# EAGLE design command (EAGLE 5.10)
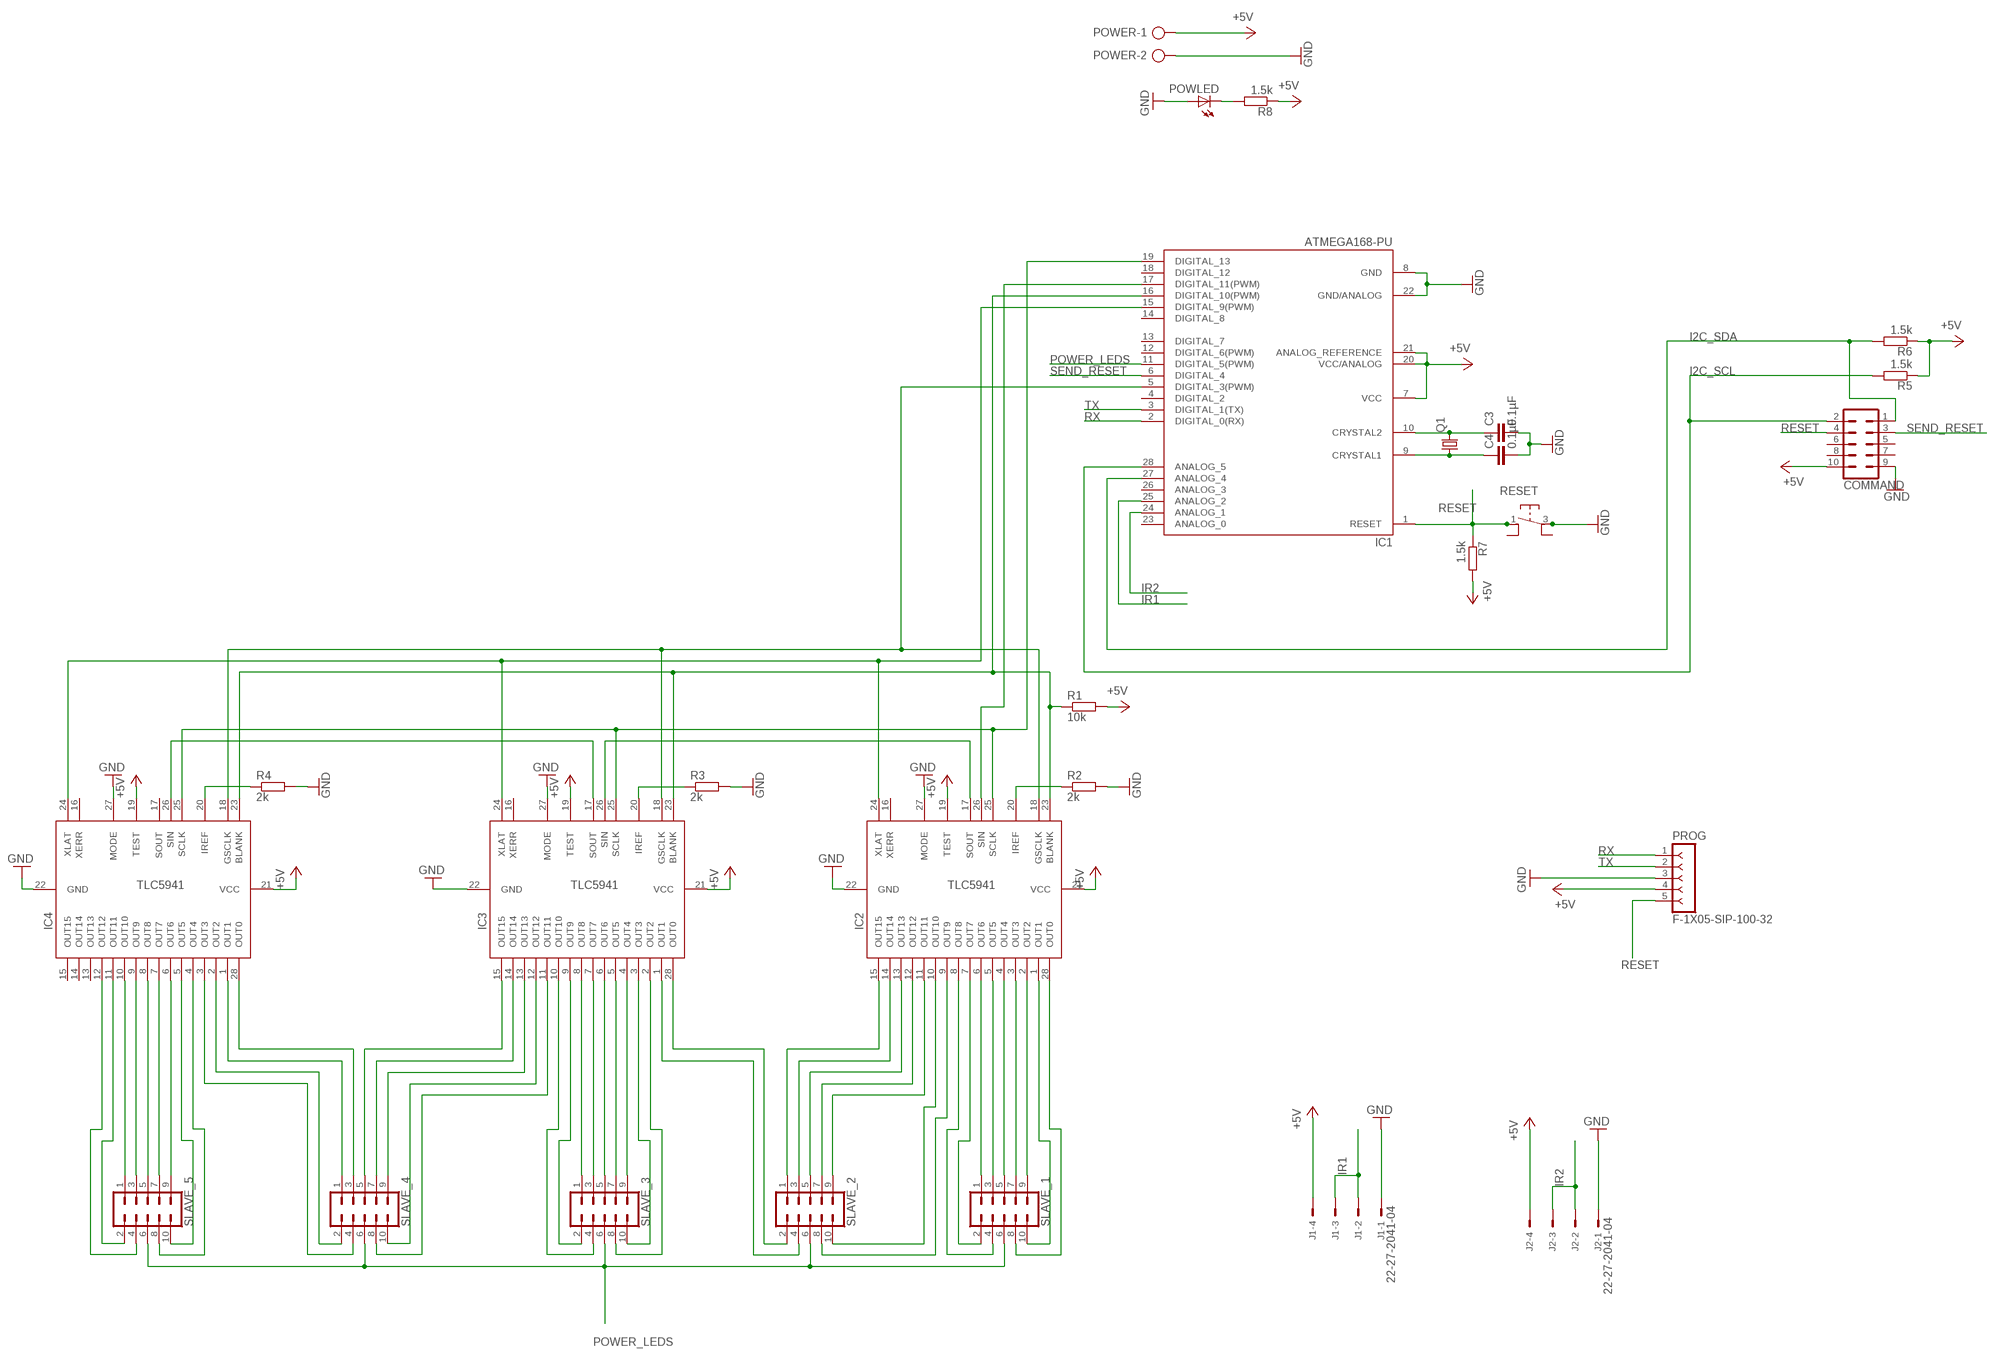
[diagram p0: schematic, sheet 1]

## Parts
C3  0.1µF  C-EU050-025X075  [C050-025X075]
C4  0.1µF  C-EU050-025X075  [C050-025X075]
COMMAND  ML10  [ML10]
IC1  ATMEGA168-PU  [DIL28-3]
IC2  TLC5941NT  [DIL28-3]
IC3  TLC5941NT  [DIL28-3]
IC4  TLC5941NT  [DIL28-3]
J1  22-27-2041-04  [6410-04]
J2  22-27-2041-04  [6410-04]
POWER  AK500/2  [AK500/2]
POWLED  LEDCHIP-LED0805  [CHIP-LED0805]
PROG  F-1X05-SIP-100-32  [SIP-100-05-32]
Q1  CRYSTALHC49U70  [HC49U70]
R1  10k  R-EU_0207/10  [0207/10]
R2  2k  R-EU_0207/10  [0207/10]
R3  2k  R-EU_0207/10  [0207/10]
R4  2k  R-EU_0207/10  [0207/10]
R5  1.5k  R-EU_0207/10  [0207/10]
R6  1.5k  R-EU_0207/10  [0207/10]
R7  1.5k  R-EU_0207/10  [0207/10]
R8  1.5k  R-EU_0207/10  [0207/10]
RESET  BUTTON_6X6_THRU  [6X6_BUTTON_THRU]
SLAVE_1  ML10  [ML10]
SLAVE_2  ML10  [ML10]
SLAVE_3  ML10  [ML10]
SLAVE_4  ML10  [ML10]
SLAVE_5  ML10  [ML10]

## Nets
+5V: COMMAND.10 IC1.7(VCC) IC1.20(VCC/ANALOG) IC1.21(ANALOG_REFERENCE) IC2.19(TEST) IC2.21(VCC) IC3.19(TEST) IC3.21(VCC) IC4.19(TEST) IC4.21(VCC) J1.4 J2.4 POWER.1 PROG.4 R1.2 R5.1 R6.1 R7.2 R8.1
B3: IC2.8(OUT8) SLAVE_1.4
B4: IC2.11(OUT11) SLAVE_2.9
B5: IC2.14(OUT14) SLAVE_2.3
B6: IC3.1(OUT1) SLAVE_2.4
B9: IC3.10(OUT10) SLAVE_3.4
B10: IC3.13(OUT13) SLAVE_4.9
B11: IC4.28(OUT0) SLAVE_4.3
B12: IC4.3(OUT3) SLAVE_4.4
B15: IC4.12(OUT12) SLAVE_5.4
BLANK: IC1.16(DIGITAL_10(PWM)) IC2.23(BLANK) IC3.23(BLANK) IC4.23(BLANK) R1.1
G1: IC2.1(OUT1) SLAVE_1.10
G3: IC2.7(OUT7) SLAVE_1.2
G4: IC2.10(OUT10) SLAVE_2.10
G5: IC2.13(OUT13) SLAVE_2.5
G6: IC3.28(OUT0) SLAVE_2.2
G7: IC3.3(OUT3) SLAVE_3.10
G9: IC3.9(OUT9) SLAVE_3.2
G10: IC3.12(OUT12) SLAVE_4.10
G11: IC3.15(OUT15) SLAVE_4.5
G12: IC4.2(OUT2) SLAVE_4.2
G13: IC4.5(OUT5) SLAVE_5.10
G15: IC4.11(OUT11) SLAVE_5.2
GND: C3.2 C4.2 COMMAND.9 IC1.8(GND) IC1.22(GND/ANALOG) IC2.22(GND) IC2.27(MODE) IC3.22(GND) IC3.27(MODE) IC4.22(GND) IC4.27(MODE) J1.1 J2.1 POWER.2 POWLED.A PROG.3 R2.2 R3.2 R4.2 RESET.3(P1)
GSCLK: IC1.5(DIGITAL_3(PWM)) IC2.18(GSCLK) IC3.18(GSCLK) IC4.18(GSCLK)
I2C_SCL: COMMAND.2 IC1.28(ANALOG_5) R5.2
I2C_SDA: COMMAND.1 IC1.27(ANALOG_4) R6.2
IR1: IC1.25(ANALOG_2) J1.2 J1.3
IR2: IC1.24(ANALOG_1) J2.2 J2.3
N$1: IC1.17(DIGITAL_11(PWM)) IC2.26(SIN)
N$2: C3.1 IC1.10(CRYSTAL2) Q1.2
N$3: C4.1 IC1.9(CRYSTAL1) Q1.1
N$5: IC4.10(OUT10) SLAVE_5.1
N$6: IC2.20(IREF) R2.1
N$7: IC2.17(SOUT) IC3.26(SIN)
N$8: IC3.17(SOUT) IC4.26(SIN)
N$9: IC3.20(IREF) R3.1
N$10: IC4.20(IREF) R4.1
N$11: IC4.9(OUT9) SLAVE_5.3
N$12: IC4.8(OUT8) SLAVE_5.5
N$13: IC4.7(OUT7) SLAVE_5.7
N$14: IC4.6(OUT6) SLAVE_5.9
N$15: IC3.4(OUT4) SLAVE_3.9
N$16: IC3.5(OUT5) SLAVE_3.7
N$17: IC3.6(OUT6) SLAVE_3.5
N$18: IC3.7(OUT7) SLAVE_3.3
N$19: IC3.8(OUT8) SLAVE_3.1
N$20: IC2.2(OUT2) SLAVE_1.9
N$21: IC2.3(OUT3) SLAVE_1.7
N$22: IC2.4(OUT4) SLAVE_1.5
N$23: IC2.5(OUT5) SLAVE_1.3
N$24: IC2.6(OUT6) SLAVE_1.1
N$25: POWLED.C R8.2
POWER_LEDS: IC1.11(DIGITAL_5(PWM)) SLAVE_1.6 SLAVE_2.6 SLAVE_3.6 SLAVE_4.6 SLAVE_5.6
R1: IC2.28(OUT0) SLAVE_1.8
R4: IC2.9(OUT9) SLAVE_2.8
R5: IC2.12(OUT12) SLAVE_2.7
R6: IC2.15(OUT15) SLAVE_2.1
R7: IC3.2(OUT2) SLAVE_3.8
R10: IC3.11(OUT11) SLAVE_4.8
R11: IC3.14(OUT14) SLAVE_4.7
R12: IC4.1(OUT1) SLAVE_4.1
R13: IC4.4(OUT4) SLAVE_5.8
RESET: COMMAND.4 IC1.1(RESET) PROG.5 R7.1 RESET.1(P2)
RX: IC1.2(DIGITAL_0(RX)) PROG.1
SCLK: IC1.19(DIGITAL_13) IC2.25(SCLK) IC3.25(SCLK) IC4.25(SCLK)
SEND_RESET: COMMAND.3 IC1.6(DIGITAL_4)
TX: IC1.3(DIGITAL_1(TX)) PROG.2
XLAT: IC1.15(DIGITAL_9(PWM)) IC2.24(XLAT) IC3.24(XLAT) IC4.24(XLAT)
Unconnected: COMMAND.5 COMMAND.6 COMMAND.7 COMMAND.8 IC1.4(DIGITAL_2) IC1.12(DIGITAL_6(PWM)) IC1.13(DIGITAL_7) IC1.14(DIGITAL_8) IC1.18(DIGITAL_12) IC1.23(ANALOG_0) IC1.26(ANALOG_3) IC2.16(XERR) IC3.16(XERR) IC4.13(OUT13) IC4.14(OUT14) IC4.15(OUT15) IC4.16(XERR) IC4.17(SOUT) RESET.2 RESET.4(P1)

## Library data of the parts
C3 C4 = rcl:C-EU: CAPACITOR, European symbol
COMMAND SLAVE_1-SLAVE_5 = con-ml:ML10: HARTING; OC_FARNELL: unknown; OC_NEWARK: unknown
IC1 = Arduino-AVR:ATMEGA168-PU
IC2-IC4 = adafruit:TLC5941
J1 J2 = con-molex:22-?-04: CONNECTOR wire to board 2.54 mm (.1 inch) pitch header; OC_FARNELL: unknown; OC_NEWARK: unknown
POWER = con-ptr500:AK500/2: CONNECTOR; OC_FARNELL: unknown; OC_NEWARK: unknown
POWLED = 0-svo:LED: LED OSRAM: - CHIPLED LG R971, LG N971, LY N971, LG Q971, LY Q971, LO R971, LY R971 LH N974, LH R974 LS Q976, LO Q976, LY Q976 LO Q996 - Hyper CHIPLED LW Q18S LB Q993, LB Q99A, LB R99A - SideLED LS A670, LO A670, LY A670, LG A670, LP A670 LB A673, LV A673, LT A673, LW A673 LH A674 LY A675 LS A676, LA A676, LO A676, LY A676, LW A676 LS A679, LY A679, LG A679 - Hyper Micro SIDELED® LS Y876, LA Y876, LO Y876, LY Y876 LT Y87S - SmartLED LW L88C, LW L88S LB L89C, LB L89S, LG L890 LS L89K, LO L89K, LY L89K LS L896, LA L896, LO L896, LY L896 - TOPLED LS T670, LO T670, LY T670, LG T670, LP T670 LSG T670, LSP T670, LSY T670, LOP T670, LYG T670 LG T671, LOG T671, LSG T671 LB T673, LV T673, LT T673, LW T673 LH T674 LS T676, LA T676, LO T676, LY T676, LB T676, LH T676, LSB T676, LW T676 LB T67C, LV T67C, LT T67C, LS T67K, LO T67K, LY T67K, LW E67C LS E67B, LA E67B, LO E67B, LY E67B, LB E67C, LV E67C, LT E67C LW T67C LS T679, LY T679, LG T679 LS T770, LO T770, LY T770, LG T770, LP T770 LB T773, LV T773, LT T773, LW T773 LH T774 LS E675, LA E675, LY E675, LS T675 LS T776, LA T776, LO T776, LY T776, LB T776 LHGB T686 LT T68C, LB T68C - Hyper Mini TOPLED® LB M676 - Mini TOPLED Santana® LG M470 LS M47K, LO M47K, LY M47K Source: http://www.osram.convergy.de/
PROG = con-headers-jp:F-1X05-: FEMALE HEADER
Q1 = crystal:CRYSTAL: CRYSTAL; OC_FARNELL: unknown; OC_NEWARK: unknown
R1-R8 = rcl:R-EU_: RESISTOR, European symbol
RESET = 0-svo:BUTTON_6X6_*

## Board
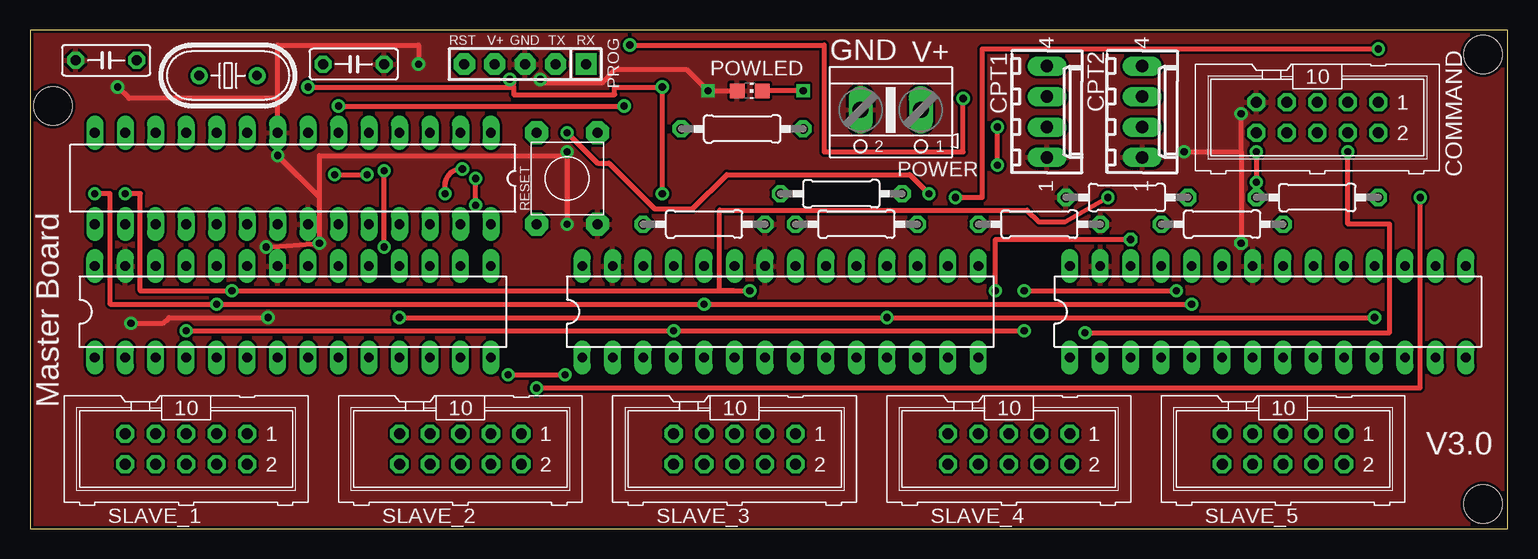
[diagram p1: board, top side]
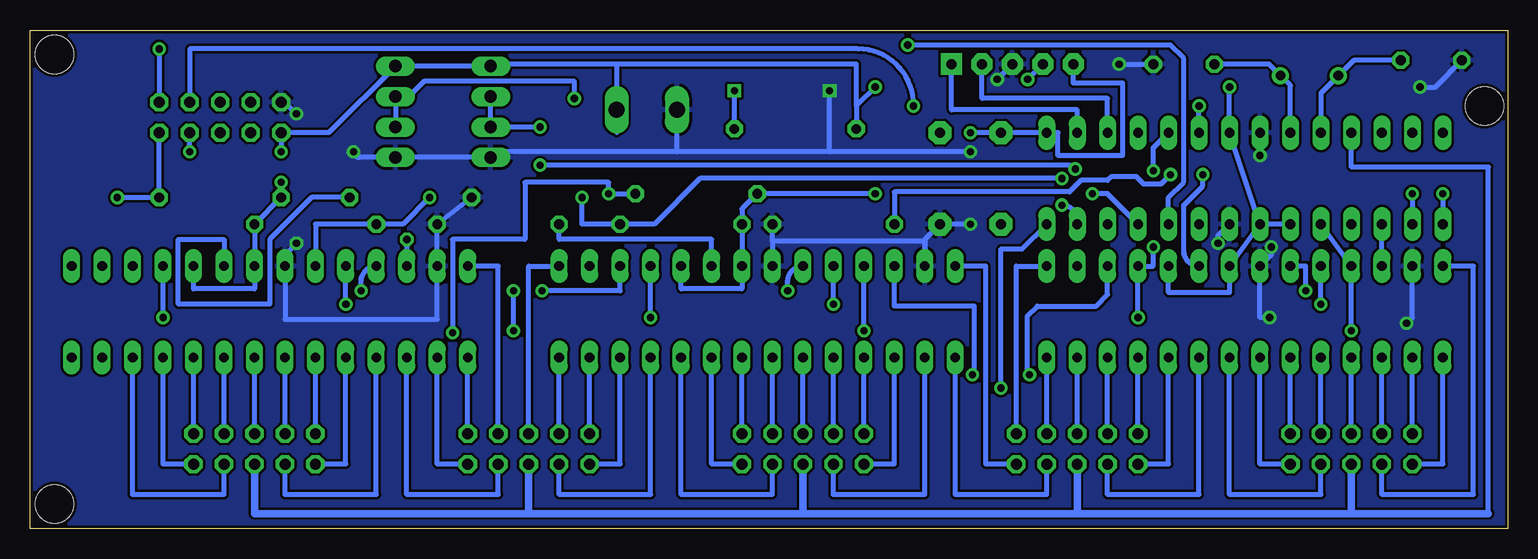
[diagram p2: board, bottom side, seen from below]

Size 123.17 x 41.58 mm. Coordinates in mm from the lower left corner, seen from the top.
Outline: 0,0 123.17,0 123.17,41.58 0,41.58 0,0
Copper layers (1*16): Top 0.035mm / dielectric 1.5mm / Bottom 0.035mm
Design rules "SparkFun": minimum track width 8mil, minimum drill 20mil, track to track 8mil, track to pad 8mil, pad to pad 8mil, via to via 8mil, smd to smd 8mil, copper to edge 10mil, drill to drill 8mil, minimum pad ring 12mil, minimum via ring 10mil, stop-mask expansion 4mil, vias tented up to drill 25mil, thermal gap 10mil
Holes 3.2 mm at 121.13,39.53 121.13,2.06 1.91,35.24

### Footprints (pad centres in the part's own frame; a part is rotated, then mirrored left to right if it is on the bottom)
C050-025X075 = drill 0.813 octagon: 1 -2.54,0; 2 2.54,0
ML10 = drill 0.914 octagon: 1 -5.08,-1.27; 2 -5.08,1.27; 3 -2.54,-1.27; 4 -2.54,1.27; 5 0,-1.27; 6 0,1.27; 7 2.54,-1.27; 8 2.54,1.27; 9 5.08,-1.27; 10 5.08,1.27
DIL28-3 = drill 0.813 long: 1 -16.51,-3.81; 2 -13.97,-3.81; 3 -11.43,-3.81; 4 -8.89,-3.81; 5 -6.35,-3.81; 6 -3.81,-3.81; 7 -1.27,-3.81; 8 1.27,-3.81; 9 3.81,-3.81; 10 6.35,-3.81; 11 8.89,-3.81; 12 11.43,-3.81; 13 13.97,-3.81; 14 16.51,-3.81; 15 16.51,3.81; 16 13.97,3.81; 17 11.43,3.81; 18 8.89,3.81; 19 6.35,3.81; 20 3.81,3.81; 21 1.27,3.81; 22 -1.27,3.81; 23 -3.81,3.81; 24 -6.35,3.81; 25 -8.89,3.81; 26 -11.43,3.81; 27 -13.97,3.81; 28 -16.51,3.81
6410-04 = drill 1.016 long: 1 3.81,0; 2 1.27,0; 3 -1.27,0; 4 -3.81,0
AK500/2 = drill 1.321 long: 1 -2.515,0; 2 2.515,0
CHIP-LED0805 = smd 1.2 x 1.2: A 0,-1.05; C 0,1.05
SIP-100-05-32 = drill 0.813 pad 1.778 square: 1 -5.08,0 | drill 0.813 pad 1.778 octagon: 2 -2.54,0; 3 0,0; 4 2.54,0; 5 5.08,0
HC49U70 = drill 0.813 round: 1 -2.413,0; 2 2.413,0
0207/10 = drill 0.813 octagon: 1 -5.08,0; 2 5.08,0
6X6_BUTTON_THRU = drill 0.813 pad 1.93 octagon: 1 -2.54,3.81; 2 -2.54,-3.81; 3 2.54,-3.81; 4 2.54,3.81

### Placement (x,y rotation side)
C3  6.35,39.05 180 top
C4  26.99,38.73 0 top
COMMAND  107.31,34.29 180 top
IC1  21.91,29.21 180 top
IC2  21.91,18.1 0 top
IC3  62.55,18.1 0 top
IC4  103.19,18.1 0 top
J1  84.77,34.77 270 top
J2  92.71,34.77 270 top
POWER  71.76,34.93 180 top
POWLED  60.01,36.51 270 top
PROG  41.28,38.73 180 top
Q1  16.51,37.78 180 top
R1  99.38,25.4 0 top
R2  56.2,25.4 0 top
R3  84.14,25.4 0 top
R4  91.44,27.62 180 top
R5  107.31,27.62 0 top
R6  68.9,25.4 0 top
R7  67.63,27.94 180 top
R8  59.37,33.34 0 top
RESET  44.77,29.21 0 top
SLAVE_1  13.02,6.67 180 top
SLAVE_2  35.88,6.67 180 top
SLAVE_3  58.74,6.67 180 top
SLAVE_4  81.6,6.67 180 top
SLAVE_5  104.46,6.67 180 top

### Tracks (layer width: path | path; a pad name or v marks a point on that pad's centre or on a via)
+5V  (via drill 0.6)
  Top 0.406: v102.23,31.43 v102.23,28.89 | v23.18,36.83 40.32,36.83 | 40.32,36.83 40.32,36.19 48.74,36.19 48.74,36.83 v52.7,36.83 v52.7,27.94 | v40,37.47 40.32,37.15 40.32,36.83
  Bottom 0.406: IC4.19 109.54,20 104.46,20 IC4.21 R1.2 R5.1 v102.23,28.89 | IC3.19 68.9,20 63.82,20 IC3.21 R6.1 63.82,26.67 R7.2 v52.7,27.94 | IC1.20 IC1.21 | IC1.21 IC1.7 v23.18,36.83 | IC1.21 IC2.21 23.18,19.68 28.26,19.68 IC2.19 | v102.23,31.43 COMMAND.10 98.27,33.02 J2.4 J1.4 84.61,38.73 74.27,38.73 | v40,37.47 PROG.4 | R8.1 54.29,35.24 54.13,35.4 | v52.7,36.83 54.13,35.4 | 74.27,33.02 POWER.1 74.27,38.73 | 74.27,38.73 54.29,38.73 54.29,35.4 54.13,35.4
B3
  Bottom 0.406: IC2.8 23.18,2.86 15.56,2.86 SLAVE_1.4
B4
  Bottom 0.406: SLAVE_2.9 IC2.11
B5
  Bottom 0.406: SLAVE_2.3 IC2.14
B6
  Bottom 0.406: IC3.1 46.04,2.86 38.42,2.86 SLAVE_2.4
B9
  Bottom 0.406: IC3.10 68.9,2.86 61.28,2.86 SLAVE_3.4
B10
  Bottom 0.406: SLAVE_4.9 IC3.13
B11
  Bottom 0.406: SLAVE_4.3 84.14,21.91 IC4.28
B12
  Bottom 0.406: IC4.3 91.76,2.86 84.14,2.86 SLAVE_4.4
B15
  Bottom 0.406: IC4.12 114.62,2.86 107,2.86 SLAVE_5.4
BLANK  (via drill 0.6)
  Top 0.406: v7.94,27.94 9.21,27.94 9.21,19.84 v16.83,19.84 58.74,19.84 | 58.74,19.84 57.49,19.84 57.49,26.58 83.12,26.58 84.11,25.59 86.25,25.59 v89.85,27.62 | 58.74,19.84 v60.01,19.84
  Bottom 0.406: IC4.23 99.38,25.4 R1.1 92.07,25.4 v89.85,27.62 | v7.94,27.94 IC1.16 | IC2.23 16.83,21.91 v16.83,19.84 | IC3.23 arc-90 60.01,20.64 v60.01,19.84
G1
  Bottom 0.406: IC2.1 5.4,5.4 SLAVE_1.10
G3
  Bottom 0.406: IC2.7 20.64,5.4 SLAVE_1.2
G4
  Bottom 0.406: IC2.10 28.26,5.4 SLAVE_2.10
G5
  Bottom 0.406: SLAVE_2.5 IC2.13
G6
  Bottom 0.406: SLAVE_2.2 43.5,5.4 43.5,21.91 IC3.28
G7
  Bottom 0.406: SLAVE_3.10 51.12,5.4 IC3.3
G9
  Bottom 0.406: IC3.9 66.36,5.4 SLAVE_3.2
G10
  Bottom 0.406: IC3.12 73.98,5.4 SLAVE_4.10
G11
  Bottom 0.406: SLAVE_4.5 81.6,21.91 IC3.15
G12
  Bottom 0.406: IC4.2 89.22,5.4 SLAVE_4.2
G13
  Bottom 0.406: IC4.5 96.84,5.4 SLAVE_5.10
G15
  Bottom 0.406: IC4.11 112.08,5.4 SLAVE_5.2
GND  (via drill 0.6)
  Top 0.406: v19.68,23.49 v24.13,23.81 24.13,27.62 | 24.13,27.62 v20.64,31.11 | 100.96,31.43 v100.96,23.81 | 100.96,31.43 v100.96,34.61 | 44.77,31.11 v44.77,25.4 | 44.77,31.11 24.13,31.11 24.13,27.62 | IC1.8 20.64,35.88 | 20.64,35.88 20.64,40.32 32.39,40.32 v32.39,38.73 | v7.3,36.83 8.26,35.88 20.64,35.88 | 44.77,31.11 v44.77,31.43 | v96.2,31.43 100.96,31.43 | v8.41,17.15 11.11,17.15 11.59,17.62 v19.84,17.62 | POWLED.A v56.51,36.51 54.77,38.26 48.74,38.26 47.63,37.15 42.86,37.15 v42.54,37.47
  Bottom 0.406: 7.94,17.62 IC2.27 | 20.64,17.62 IC2.22 19.68,22.86 v19.68,23.49 | R4.2 R3.2 IC4.27 89.22,17.46 101.92,17.46 IC4.22 101.92,22.86 v100.96,23.81 | 61.28,23.97 IC3.22 | 61.28,23.97 R2.2 | IC1.22 24.13,24.45 v24.13,23.81 | v20.64,31.11 IC1.8 | v100.96,34.61 101.92,35.56 COMMAND.9 | v44.77,25.4 RESET.3 48.58,24.13 IC3.27 48.58,23.97 61.28,23.97 | C3.2 6.03,36.83 v7.3,36.83 | v32.39,38.73 C4.2 | 69.24,31.43 POWER.2 | v44.77,31.43 56.51,31.43 | 56.51,31.43 69.24,31.43 | 56.51,31.43 v56.51,36.51 | 7.94,17.62 | v8.41,17.15 7.94,17.62 | v19.84,17.62 20.64,17.62 | 20.64,17.62 | v96.2,31.43 arc-90 95.73,30.96 J2.1 J1.1 84.3,31.43 69.24,31.43 | v42.54,37.47 PROG.3
  pour Top: 0,41.59 123.19,41.59 123.19,0 0,0
  pour Bottom: 0,41.59 123.19,41.59 123.19,0 0,0
GSCLK  (via drill 0.6)
  Top 0.406: v30.8,17.62 v71.44,17.62 v112.08,17.62 | v29.53,23.49 v29.53,29.84
  Bottom 0.406: v71.44,17.62 IC3.18 | v30.8,17.62 IC2.18 29.53,21.91 v29.53,23.49 | v29.53,29.84 29.53,31.75 IC1.5 | v112.08,17.62 IC4.18
I2C_SCL  (via drill 0.6)
  Top 0.406: v42.23,11.75 115.89,11.75 v115.89,27.62
  Bottom 0.406: COMMAND.2 R5.2 v115.89,27.62 | IC1.28 40.48,23.34 42.23,23.34 v42.23,11.75
I2C_SDA  (via drill 0.6)
  Top 0.406: v37.15,26.99 v37.15,29.21 | v112.4,40.01 79.38,40.01 79.38,27.62 v77.15,27.62
  Bottom 0.406: v37.15,29.21 67.31,29.21 71.12,25.4 R6.2 77.15,25.4 v77.15,27.62 | v112.4,40.01 COMMAND.1 | IC1.27 35.88,25.72 arc-90 v37.15,26.99
IR1  (via drill 0.6)
  Top 0.406: v34.61,27.94 34.61,28.73 arc-90 v36.04,30 | v80.65,30.32 v80.65,33.5
  Bottom 0.406: J1.3 J1.2 v80.65,33.5 | IC1.25 33.34,27.94 v34.61,27.94 | v36.04,30 36.51,30.32 v80.65,30.32
IR2  (via drill 0.6)
  Top 0.406: v50.01,40.32 66.2,40.32 66.2,31.43 77.79,31.43 v77.79,35.88
  Bottom 0.406: J2.2 J2.3 91.6,36.04 90.33,37.31 77.79,37.31 v77.79,35.88 | IC1.24 28.26,27.62 26.99,28.89 26.99,39.21 28.1,40.32 v50.01,40.32
N$1
  Bottom 0.406: IC2.26 IC1.17
N$2
  Bottom 0.406: IC1.10 15.56,36.32 Q1.2 12.83,39.05 C3.1
N$3
  Bottom 0.406: IC1.9 18.1,36.96 Q1.1 19.88,38.73 C4.1
N$5
  Bottom 0.406: SLAVE_5.1 IC4.10
N$6  (via drill 0.6)
  Top 0.406: v25.4,29.53 v28.1,29.53
  Bottom 0.406: IC2.20 arc90 26.99,23.18 26.99,26.99 25.4,28.58 v25.4,29.53 | R2.1 51.12,28.1 36.51,28.1 35.56,29.05 33.34,29.05 33.02,29.37 30.96,29.37 30.32,28.73 28.89,28.73 v28.1,29.53
N$7  (via drill 0.6)
  Top 0.406: v39.85,12.86 v44.61,12.86
  Bottom 0.406: IC2.17 33.34,19.53 34.29,18.57 39.21,18.57 40,17.78 40,12.86 v39.85,12.86 | v44.61,12.86 44.45,12.54 44.45,18.57 51.12,18.57 IC3.26
N$8  (via drill 0.6)
  Top 0.406: v91.76,24.13 80.49,24.13 v80.49,19.84
  Bottom 0.406: v91.76,24.13 IC4.26 | v80.49,19.84 73.98,19.84 IC3.17
N$9
  Bottom 0.406: IC3.20 66.36,24.13 79.06,24.13 R3.1
N$10
  Bottom 0.406: R4.1 99.7,27.62 103.19,24.13 103.19,18.73 110.81,18.73 110.81,24.13 107,24.13 IC4.20
N$11
  Bottom 0.406: SLAVE_5.3 IC4.9
N$12
  Bottom 0.406: SLAVE_5.5 IC4.8
N$13
  Bottom 0.406: SLAVE_5.7 IC4.7
N$14
  Bottom 0.406: SLAVE_5.9 IC4.6
N$15
  Bottom 0.406: SLAVE_3.9 IC3.4
N$16
  Bottom 0.406: SLAVE_3.7 IC3.5
N$17
  Bottom 0.406: SLAVE_3.5 IC3.6
N$18
  Bottom 0.406: SLAVE_3.3 IC3.7
N$19
  Bottom 0.406: SLAVE_3.1 IC3.8
N$20
  Bottom 0.406: SLAVE_1.9 IC2.2
N$21
  Bottom 0.406: SLAVE_1.7 IC2.3
N$22
  Bottom 0.406: SLAVE_1.5 IC2.4
N$23
  Bottom 0.406: SLAVE_1.3 IC2.5
N$24
  Bottom 0.406: SLAVE_1.1 IC2.6
N$25  (via drill 0.6)
  Top 0.406: v64.45,36.51 POWLED.C
  Bottom 0.406: R8.2 v64.45,36.51
POWER_LEDS
  Bottom 0.406: IC1.11 13.02,30.16 1.59,30.16 1.59,1.27
  Bottom 0.61: SLAVE_5.6 104.46,1.27 81.6,1.27 | 35.88,1.27 58.74,1.27 | 13.02,1.27 SLAVE_1.6 | 35.88,1.27 SLAVE_2.6 | 13.02,1.27 35.88,1.27 | 58.74,1.27 SLAVE_3.6 | 58.74,1.27 81.6,1.27 | 81.6,1.27 SLAVE_4.6 | 1.59,1.27 13.02,1.27
R1
  Bottom 0.406: SLAVE_1.8 10.48,2.86 2.86,2.86 2.86,21.91 IC2.28
R4
  Bottom 0.406: IC2.9 25.72,2.86 33.34,2.86 SLAVE_2.8
R5
  Bottom 0.406: SLAVE_2.7 IC2.12
R6
  Bottom 0.406: IC2.15 40.96,21.91 SLAVE_2.1
R7
  Bottom 0.406: IC3.2 48.58,2.86 56.2,2.86 SLAVE_3.8
R10
  Bottom 0.406: IC3.11 71.44,2.86 79.06,2.86 SLAVE_4.8
R11
  Bottom 0.406: SLAVE_4.7 IC3.14
R12
  Bottom 0.406: SLAVE_4.1 IC4.1
R13
  Bottom 0.406: IC4.4 94.3,2.86 101.92,2.86 SLAVE_5.8
RESET  (via drill 0.6)
  Top 0.406: v44.77,33.02 47.31,30.48 48.26,30.48 52.07,26.67 55.25,26.67 58.1,29.53 73.34,29.53 v74.93,27.94 | v87.95,16.35 113.35,16.35 113.35,25.4 109.85,25.4 v109.85,31.43
  Bottom 0.406: PROG.5 36.2,37.15 32.07,37.15 32.07,31.11 37.46,31.11 37.46,33.02 IC1.1 RESET.1 v44.77,33.02 | R7.1 v74.93,27.94 74.93,28.89 81.92,28.89 81.92,24.13 87.95,24.13 v87.95,16.35 | v109.85,31.43 COMMAND.4
RX
  Bottom 0.406: IC1.2 35.88,34.93 46.35,34.93 PROG.1
SCLK  (via drill 0.6)
  Top 0.406: v13.02,16.51 v53.66,16.51 v82.87,16.51 | v82.87,19.84 v95.57,19.84
  Bottom 0.406: IC1.19 IC2.25 v13.02,16.51 | v53.66,16.51 IC3.25 | v82.87,16.51 v82.87,19.84 | IC4.25 arc-90 95.57,20.64 v95.57,19.84
SEND_RESET  (via drill 0.6)
  Top 0.406: v25.72,35.24 v49.53,35.24
  Bottom 0.406: IC1.6 v25.72,35.24 | COMMAND.3 109.85,40.01 54.13,40.01 arc92 v49.53,35.24
TX
  Bottom 0.406: IC1.3 33.34,35.88 43.82,35.88 PROG.2
XLAT  (via drill 0.6)
  Top 0.406: v5.4,27.94 6.67,27.94 6.67,18.73 v15.56,18.73 v56.2,18.73 v96.84,18.73
  Bottom 0.406: v5.4,27.94 IC1.15 | v15.56,18.73 IC2.24 | v96.84,18.73 IC4.24 | v56.2,18.73 IC3.24

### Text on the board
tNames: RST | V+ | GND | TX | RX | GND | V+ | CPT1 | CPT2 | Master Board | V3.0